# Altium schematic sheet TMS320F28379D_ADC.SchDoc
size A4
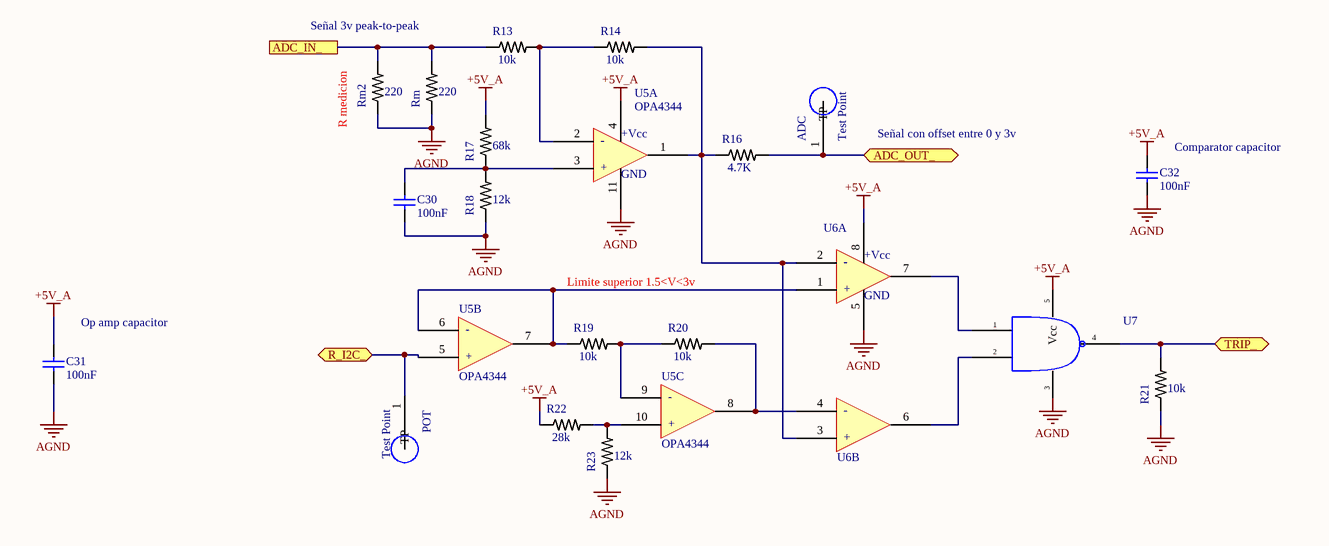
[diagram p0: TMS320F28379D_ADC.SchDoc]

## Parts
ADC  Test Point  [Test point]
C30  value 100nF  [CAP 0805]  (hidden comment: Cap cerámico)
C31  value 100nF  [CAP 0805]  (hidden comment: Cap cerámico)
C32  value 100nF  [CAP 0805]  (hidden comment: Cap cerámico)
POT  Test Point  [Test point]
R13  value 10k  [Resistor 0805]  (hidden comment: Resistor 0805)
R14  value 10k  [Resistor 0805]  (hidden comment: Resistor 0805)
R16  value 4.7K  [Resistor 0805]  (hidden comment: Resistor 0805)
R17  value 68k  [Resistor 0805]  (hidden comment: Resistor 0805)
R18  value 12k  [Resistor 0805]  (hidden comment: Resistor 0805)
R19  value 10k  [Resistor 0805]  (hidden comment: Resistor 0805)
R20  value 10k  [Resistor 0805]  (hidden comment: Resistor 0805)
R21  value 10k  [Resistor 0805]  (hidden comment: Resistor 0805)
R22  value 28k  [Resistor 0805]  (hidden comment: Resistor 0805)
R23  value 12k  [Resistor 0805]  (hidden comment: Resistor 0805)
Rm  value 220  [Resistor 0805]  (hidden comment: Resistor 0805)
Rm2  value 220  [Resistor 0805]  (hidden comment: Resistor 0805)
U5  OPA4344  [14-TSSOP]  (parts A,B,C of 4)
U6  MAX962  [8-TSSOP]  (value not drawn)  (parts A,B of 2)
U7  SN74LVC1G00DBVR  [SOT-553]  (value not drawn)

## Ports
ADC_IN_, ADC_OUT_, R_I2C_, TRIP_

## Nets
+5V_A: C31.2 C32.1 R17.2 R22.1 U5.4(v+) U6.8(VCC) U7.5(Vcc)
AGND: C30.1 C31.1 C32.2 R18.1 R21.1 R23.1 Rm.1 Rm2.1 U5.11(v-) U6.5(GND) U7.3(GND)
ADC_IN_: R13.1 Rm.2 Rm2.2 ; port ADC_IN_
ADC_OUT_: ADC.1(TP) R16.2 ; port ADC_OUT_
R_I2C_: POT.1(TP) U5.5(+in_b) ; port R_I2C_
TRIP_: R21.2 U7.4 ; port TRIP_
NetC30_2: C30.2 R17.1 R18.2 U5.3(+in_a)
NetR13_2: R13.2 R14.1 U5.2(-in_a)
NetR14_2: R14.2 R16.1 U5.1(out_a) U6.2(-in_a) U6.3(+IN_B)
NetR19_1: R19.1 U5.6(-in_b) U5.7(out_b) U6.1(+in_a)
NetR19_2: R19.2 R20.1 U5.9(-in_c)
NetR20_2: R20.2 U5.8(out_c) U6.4(-IN_B)
NetR22_2: R22.2 R23.2 U5.10(+in_c)
NetU6_6: U6.6(OUT_B) U7.2
NetU6_7: U6.7(out_a) U7.1

## Notes on the sheet
- Señal 3v peak-to-peak
- (near Rm2) R medicion
- Señal con offset entre 0 y 3v
- (near C32) Comparator capacitor
- (near C31) Op amp capacitor
- Limite superior 1.5<V<3v
- (in symbol MAX962, part A) +Vcc; -; +
- (in symbol MAX962, part B) -; +
- (in symbol OPA4344, part A) +Vcc; -; +; GND
- (in symbol OPA4344, part B) -; +
- (in symbol OPA4344, part C) -; +

## Library data of the parts
ADC POT = Test Point: Surface Mount Test Points; Manufacturer Part Number: RCW-0C; Código de producto RS: 389-801; Digi-Key Part Number: A106146CT-ND
R13 R14 R16-R23 = Resistor: Digi-Key Part Number: *; Manufacturer Part Number: *
Rm Rm2 = Resistor: Manufacturer Part Number: RCL1218220RFKEK; Digi-Key Part Number: RCL220ACT-ND
U5 = OPA4344: Manufacturer Part Number: OPA4344EA/250; Código de producto RS: 660-9868; Digi-Key Part Number: OPA4344EACT-ND
U6 = MAX962: Manufacturer Part Number: MAX962EUA+; Código de producto RS: 622-9241; Digi-Key Part Number: MAX962EUA+-ND
U7 = SN74LVC1G00DBVR: IC GATE NAND 1CH 2-INP; Manufacturer Part Number: M74VHC1GT00DFT1G; Código de producto RS: 805-1517; Digi-Key Part Number: M74VHC1GT00DFT1GOSCT-ND
C30-C32 = Cap cerámico: Digi-Key Part Number: *; Manufacturer Part Number: *